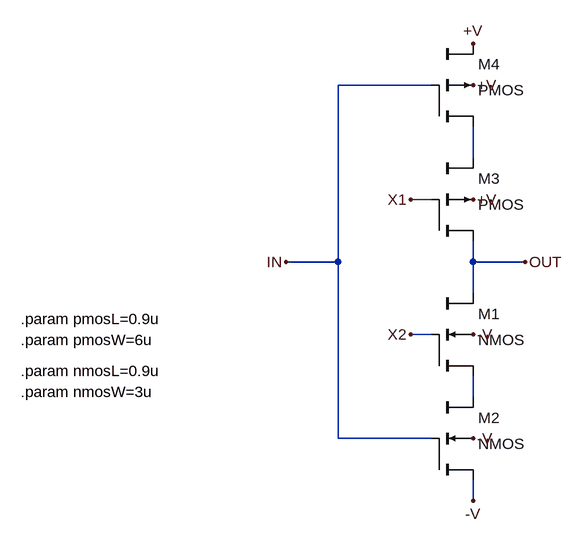
[diagram p0: schematic InverterInputs.asc]
InverterInputs.asc, the LTspice schematic file:
Version 4
SHEET 1 880 680
WIRE 256 -160 112 -160
WIRE 320 -48 320 -96
WIRE 256 16 224 16
WIRE 112 112 112 -160
WIRE 112 112 32 112
WIRE 320 112 320 80
WIRE 400 112 320 112
WIRE 320 160 320 112
WIRE 256 224 224 224
WIRE 320 320 320 288
WIRE 112 384 112 112
WIRE 256 384 112 384
WIRE 320 480 320 448
FLAG 320 480 -V
FLAG 320 384 -V
FLAG 320 224 -V
FLAG 320 16 +V
FLAG 320 -160 +V
FLAG 320 -224 +V
FLAG 32 112 IN
FLAG 400 112 OUT
FLAG 224 16 X1
FLAG 224 224 X2
SYMBOL cktsym\\nmos4 320 224 R0
SYMATTR InstName M1
SYMATTR Value2 l=nmosL w=nmosW
SYMBOL cktsym\\nmos4 320 384 R0
SYMATTR InstName M2
SYMATTR Value2 l=nmosL w=nmosW
SYMBOL cktsym\\pmos4 320 16 R0
SYMATTR InstName M3
SYMATTR Value2 l=pmosL w=pmosW
SYMBOL cktsym\\pmos4 320 -160 R0
SYMATTR InstName M4
SYMATTR Value2 l=pmosL w=pmosW
TEXT -376 280 Left 2 !.param nmosL=0.9u
TEXT -376 312 Left 2 !.param nmosW=3u
TEXT -376 200 Left 2 !.param pmosL=0.9u
TEXT -376 232 Left 2 !.param pmosW=6u

The netlist it stands for:
* InverterInputs.asc
M1 OUT X2 N002 -V NMOS l=nmosL w=nmosW
M2 N002 IN -V -V NMOS l=nmosL w=nmosW
M3 OUT X1 N001 +V PMOS l=pmosL w=pmosW
M4 N001 IN +V +V PMOS l=pmosL w=pmosW
.model NMOS NMOS
.model PMOS PMOS
.lib standard.mos
.param nmosL=0.9u
.param nmosW=3u
.param pmosL=0.9u
.param pmosW=6u
.backanno
.end